# Altium schematic sheet cirrus-audio.SchDoc: Cirrus Audio Board
size A4; Organization: heig-vd; Address1: heig-vd; Address2: Route de Cheseaux 1; Address3: 1401 Yverdon-les-Bains; Address4: Suisse; DocumentNumber: 3; Revision: 1.1; SheetNumber: 3; SheetTotal: 12
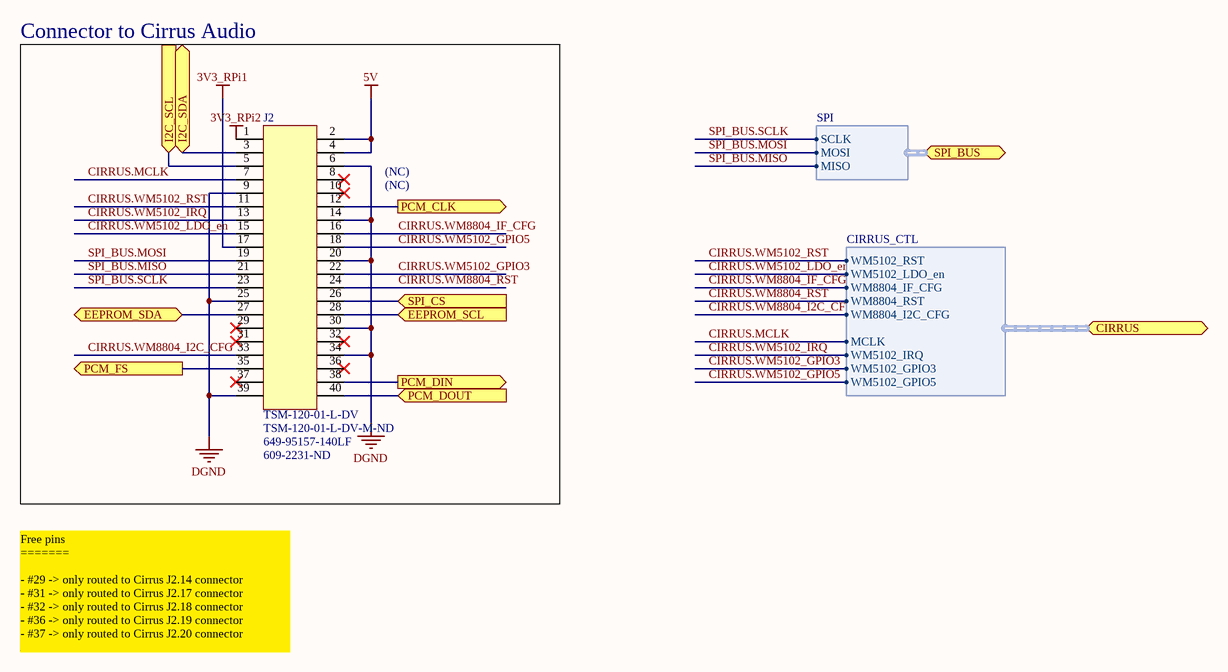
[diagram p0: cirrus-audio.SchDoc]

## Parts
J2  TSM-120-01-L-DV  Supplier Part Number 1: TSM-120-01-L-DV-M-ND  Supplier Part Number 2: 649-95157-140LF  Supplier Part Number 3: 609-2231-ND  [TSM-120-04-L-DV]

## Blocks framed on the sheet
Connector to Cirrus Audio: J2

## Ports
CIRRUS (harness CIRRUS_CTL), EEPROM_SCL (in), EEPROM_SDA (bidir), I2C_SCL (in), I2C_SDA (bidir), PCM_CLK (out), PCM_DIN (out), PCM_DOUT (in), PCM_FS (out), SPI_BUS (harness SPI), SPI_CS (in)

## Harnesses
CIRRUS_CTL: WM5102_RST, WM5102_LDO_en, WM8804_IF_CFG, WM8804_RST, WM8804_I2C_CFG, MCLK, WM5102_IRQ, WM5102_GPIO3, WM5102_GPIO5
SPI: SCLK, MOSI, MISO

## Nets
3V3_RPi1: J2.17
3V3_RPi2: J2.1
5V: J2.2 J2.4
DGND: J2.6 J2.9 J2.14 J2.20 J2.25 J2.30 J2.34 J2.39
CIRRUS.MCLK: J2.7 ; port CIRRUS.MCLK
CIRRUS.WM5102_GPIO3: J2.22 ; port CIRRUS.WM5102_GPIO3
CIRRUS.WM5102_GPIO5: J2.18 ; port CIRRUS.WM5102_GPIO5
CIRRUS.WM5102_IRQ: J2.13 ; port CIRRUS.WM5102_IRQ
CIRRUS.WM5102_LDO_en: J2.15 ; port CIRRUS.WM5102_LDO_en
CIRRUS.WM5102_RST: J2.11 ; port CIRRUS.WM5102_RST
CIRRUS.WM8804_I2C_CFG: J2.33 ; port CIRRUS.WM8804_I2C_CFG
CIRRUS.WM8804_IF_CFG: J2.16 ; port CIRRUS.WM8804_IF_CFG
CIRRUS.WM8804_RST: J2.24 ; port CIRRUS.WM8804_RST
EEPROM_SCL: J2.28 ; port EEPROM_SCL
EEPROM_SDA: J2.27 ; port EEPROM_SDA
I2C_SCL: J2.5 ; port I2C_SCL
I2C_SDA: J2.3 ; port I2C_SDA
PCM_CLK: J2.12 ; port PCM_CLK
PCM_DIN: J2.38 ; port PCM_DIN
PCM_DOUT: J2.40 ; port PCM_DOUT
PCM_FS: J2.35 ; port PCM_FS
SPI_BUS.MISO: J2.21 ; port SPI_BUS.MISO
SPI_BUS.MOSI: J2.19 ; port SPI_BUS.MOSI
SPI_BUS.SCLK: J2.23 ; port SPI_BUS.SCLK
SPI_CS: J2.26 ; port SPI_CS

Not connected (* = marked no-connect by the designer): J2 8* 10* 29* 31* 32* 36* 37*

## Notes on the sheet
- (NC)
- Free pins
  =======
  - #29 -> only routed to Cirrus J2.14 connector
  - #31 -> only routed to Cirrus J2.17 connector
  - #32 -> only routed to Cirrus J2.18 connector
  - #36 -> only routed to Cirrus J2.19 connector
  - #37 -> only routed to Cirrus J2.20 connector
- Route de Cheseaux 1
- CH-1401 Yverdon-les-Bains
- Titre:
- Date:
- Projet:
- Revision:
- Sheet
- of
- File:

## Library data of the parts
J2 = TSM-120-01-L-DV: Mating (male) connector for the RPi 3; Supplier 1: Digi-Key; Supplier 2: Mouser; Supplier 3: Digi-Key; Supplier 4: Farnell; Supplier Part Number 4: 1915231